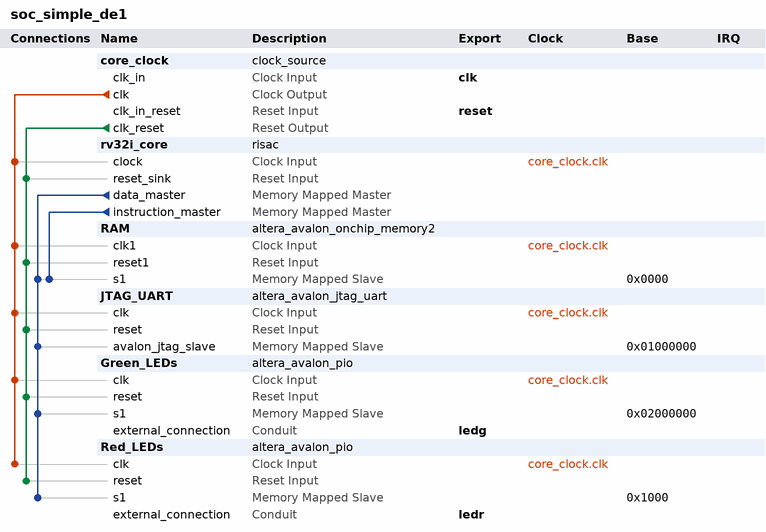
[diagram p0: system contents]
# Platform Designer (Qsys) system soc_simple_de1, Cyclone II EP2C20F484C7
# Parameters at their usual value, and those the tool derives, are not listed.
package require -exact qsys 13.0.1
create_system soc_simple_de1
set_project_property DEVICE_FAMILY {Cyclone II}
set_project_property DEVICE EP2C20F484C7

add_instance core_clock clock_source 13.0
set_instance_parameter_value core_clock clockFrequency 50000000

add_instance rv32i_core risac 1.0

add_instance RAM altera_avalon_onchip_memory2 13.0.1
set_instance_parameter_value RAM dataWidth 32
set_instance_parameter_value RAM dualPort false
set_instance_parameter_value RAM initMemContent true
set_instance_parameter_value RAM initializationFileName onchip_mem.hex
set_instance_parameter_value RAM memorySize 4096

add_instance JTAG_UART altera_avalon_jtag_uart 13.0.1
set_instance_parameter_value JTAG_UART simInteractiveOptions NO_INTERACTIVE_WINDOWS

add_instance Green_LEDs altera_avalon_pio 13.0.1
set_instance_parameter_value Green_LEDs direction Output
set_instance_parameter_value Green_LEDs width 8

add_instance Red_LEDs altera_avalon_pio 13.0.1
set_instance_parameter_value Red_LEDs direction Output
set_instance_parameter_value Red_LEDs width 10

# connections
add_connection core_clock.clk Green_LEDs.clk clock
add_connection core_clock.clk JTAG_UART.clk clock
add_connection core_clock.clk RAM.clk1 clock
add_connection core_clock.clk Red_LEDs.clk clock
add_connection core_clock.clk rv32i_core.clock clock
add_connection core_clock.clk_reset Green_LEDs.reset reset
add_connection core_clock.clk_reset JTAG_UART.reset reset
add_connection core_clock.clk_reset RAM.reset1 reset
add_connection core_clock.clk_reset Red_LEDs.reset reset
add_connection core_clock.clk_reset rv32i_core.reset_sink reset
add_connection rv32i_core.data_master Green_LEDs.s1 avalon
set_connection_parameter_value rv32i_core.data_master/Green_LEDs.s1 baseAddress 0x02000000
add_connection rv32i_core.data_master JTAG_UART.avalon_jtag_slave avalon
set_connection_parameter_value rv32i_core.data_master/JTAG_UART.avalon_jtag_slave baseAddress 0x01000000
add_connection rv32i_core.data_master RAM.s1 avalon
set_connection_parameter_value rv32i_core.data_master/RAM.s1 baseAddress 0x0000
add_connection rv32i_core.data_master Red_LEDs.s1 avalon
set_connection_parameter_value rv32i_core.data_master/Red_LEDs.s1 baseAddress 0x1000
add_connection rv32i_core.instruction_master RAM.s1 avalon
set_connection_parameter_value rv32i_core.instruction_master/RAM.s1 baseAddress 0x0000

# exported interfaces
add_interface clk clock sink
set_interface_property clk EXPORT_OF core_clock.clk_in
add_interface reset reset sink
set_interface_property reset EXPORT_OF core_clock.clk_in_reset
add_interface ledg conduit end
set_interface_property ledg EXPORT_OF Green_LEDs.external_connection
add_interface ledr conduit end
set_interface_property ledr EXPORT_OF Red_LEDs.external_connection

set_interconnect_requirement {$system} qsys_mm.clockCrossingAdapter HANDSHAKE
set_interconnect_requirement {$system} qsys_mm.maxAdditionalLatency 3

save_system soc_simple_de1.qsys
